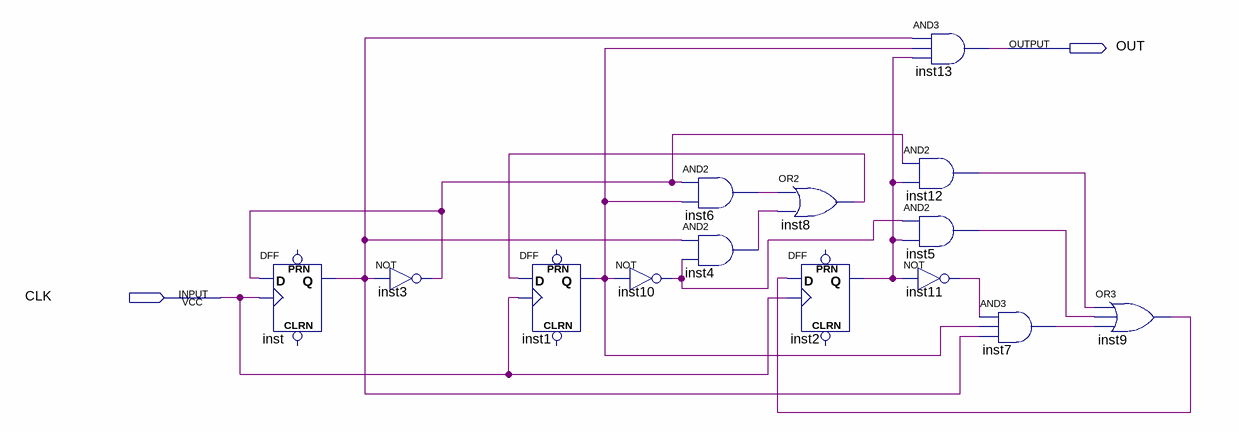
[diagram p0: schematic sheet]
// Quartus schematic Modulo8_Syn_Counter.bdf as structural Verilog: 14 symbols, 2 pins
module Modulo8_Syn_Counter (
  input  CLK,
  output OUT
);

  wire inst1_q, inst2_q, inst3_out, inst4_out, inst5_out, inst6_out, inst7_out, inst8_out, inst9_out,
       inst10_out, inst11_out, inst12_out, inst_q;

  DFF inst (.CLK(CLK), .D(inst3_out), .Q(inst_q));  // open: CLRN, PRN
  not inst3 (inst3_out, inst_q);
  DFF inst1 (.CLK(CLK), .D(inst8_out), .Q(inst1_q));  // open: CLRN, PRN
  not inst10 (inst10_out, inst1_q);
  and inst6 (inst6_out, inst3_out, inst1_q);
  and inst4 (inst4_out, inst_q, inst10_out);
  or inst8 (inst8_out, inst6_out, inst4_out);
  DFF inst2 (.CLK(CLK), .D(inst9_out), .Q(inst2_q));  // open: CLRN, PRN
  and inst13 (OUT, inst_q, inst1_q, inst2_q);
  and inst12 (inst12_out, inst3_out, inst2_q);
  and inst5 (inst5_out, inst10_out, inst2_q);
  not inst11 (inst11_out, inst2_q);
  and inst7 (inst7_out, inst11_out, inst1_q, inst_q);
  or inst9 (inst9_out, inst12_out, inst5_out, inst7_out);
endmodule
